# EAGLE schematic 1stLayer2018v1 (EAGLE 9.2.2)

## Sheet 1 of 8: Light Sensor Circuit
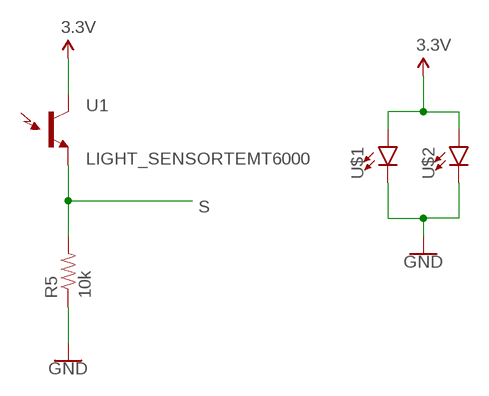
[diagram p0: schematic, sheet 1]

### Parts
R5  10k  10KOHM-0603-1/10W-1%  [0603]
U1  LIGHT_SENSORTEMT6000  [TEMT6000]
U$1  3528LED  [3528]
U$2  3528LED  [3528]

### Nets
3.3V: U1.COLLECTOR(C1) U$1.A U$2.A ; also sheet 2,3,4,7
GND: R5.1 U$1.C U$2.C ; also sheet 2,3,4,5,7
S: R5.2 U1.EMITTER(E1)

## Sheet 2 of 8: TPS5450 Buck Circuit
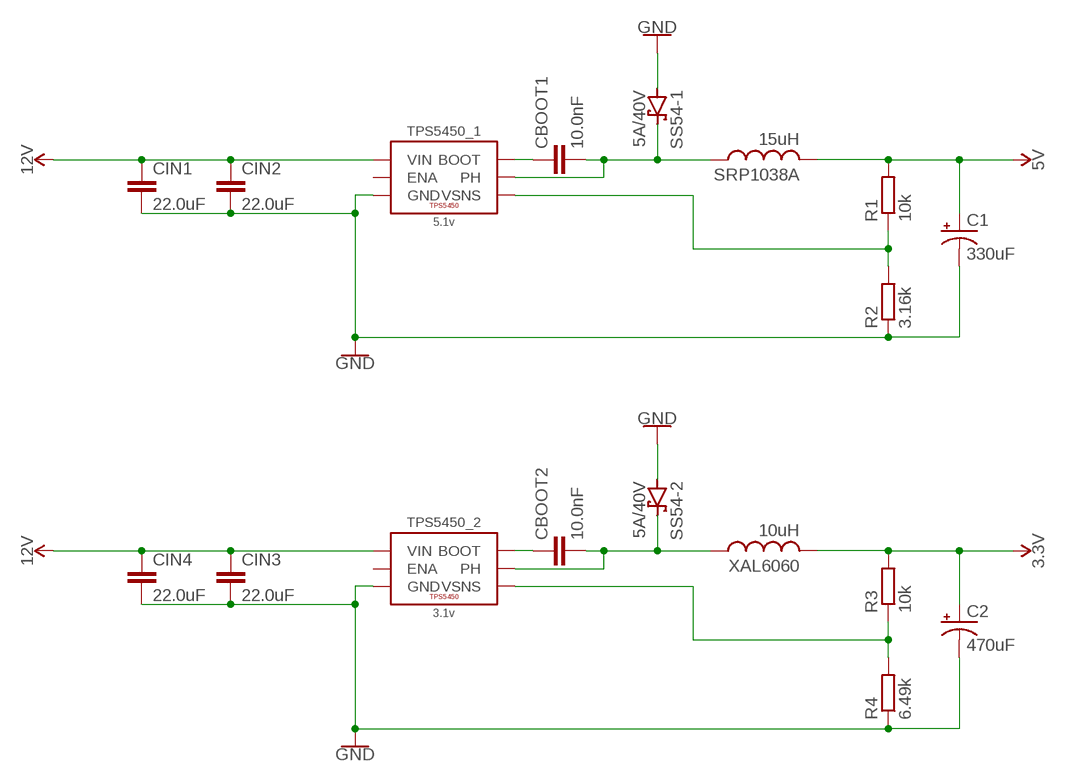
[diagram p1: schematic, sheet 2]

### Parts
C1  330uF  CPOL-USD/7343-31R  [D/7343-31R]
C2  470uF  CPOL-USD/7343-31R  [D/7343-31R]
CBOOT1  10.0nF  C-EUC0603  [C0603]
CBOOT2  10.0nF  C-EUC0603  [C0603]
CIN1  22.0uF  C-EUC1210  [C1210]
CIN2  22.0uF  C-EUC1210  [C1210]
CIN3  22.0uF  C-EUC1210  [C1210]
CIN4  22.0uF  C-EUC1210  [C1210]
R1  10k  R-EU_R0603  [R0603]
R2  3.16k  R-EU_R0603  [R0603]
R3  10k  R-EU_R0603  [R0603]
R4  6.49k  R-EU_R0603  [R0603]
SRP1038A  15uH  SRP1038A  [SRP1038A]
SS54-1  5A/40V  SCHOTTKY-DIODESMD  [SMB]
SS54-2  5A/40V  SCHOTTKY-DIODESMD  [SMB]
TPS5450_1  5.1v  TPS5450  [POWERPAD-SOIC-8]
TPS5450_2  3.1v  TPS5450  [POWERPAD-SOIC-8]
XAL6060  10uH  XAL6060  [XAL6060]

### Nets
3.3V: C2.+ R3.2 XAL6060.2 ; also sheet 1,3,4,7
5V: C1.+ R1.2 SRP1038A.2 ; also sheet 3
12V: CIN1.1 CIN2.1 CIN3.1 CIN4.1 TPS5450_1.7(VIN) TPS5450_2.7(VIN) ; also sheet 3,4,5
GND: C1.- C2.- CIN1.2 CIN2.2 CIN3.2 CIN4.2 R2.1 R4.1 SS54-1.A SS54-2.A TPS5450_1.6(GND) TPS5450_1.9(GND) TPS5450_2.6(GND) TPS5450_2.9(GND) ; also sheet 1,3,4,5,7
N$1: CBOOT1.2 SRP1038A.1 SS54-1.C TPS5450_1.8(PH)
N$2: CBOOT2.1 TPS5450_2.1(BOOT)
N$3: CBOOT1.1 TPS5450_1.1(BOOT)
N$4: R1.1 R2.2 TPS5450_1.4(VSNS)
N$5: CBOOT2.2 SS54-2.C TPS5450_2.8(PH) XAL6060.1
N$6: R3.1 R4.2 TPS5450_2.4(VSNS)
Unconnected: TPS5450_1.2(NC) TPS5450_1.3(NC) TPS5450_1.5(ENA) TPS5450_2.2(NC) TPS5450_2.3(NC) TPS5450_2.5(ENA)

## Sheet 3 of 8: MAX1522 Boost Converter Circuit
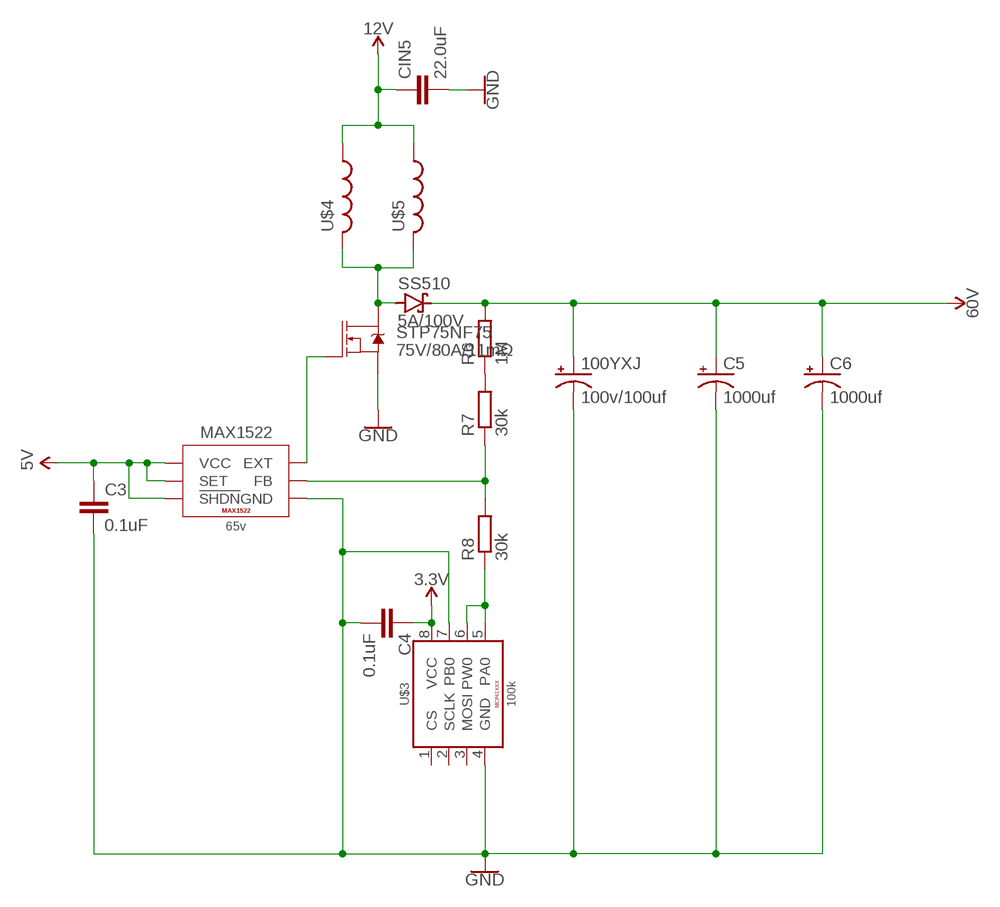
[diagram p2: schematic, sheet 3]

### Parts
100YXJ  100v/100uf  CPOL-USE5-10.5  [E5-10,5]
C3  0.1uF  C-EUC0603  [C0603]
C4  0.1uF  C-EUC0603  [C0603]
C5  1000uf  100UF-CAP  [1000UF-CAP]
C6  1000uf  100UF-CAP  [1000UF-CAP]
CIN5  22.0uF  C-EUC1210  [C1210]
MAX1522  65v  MAX1522EUT+T  [SOT23-6]
R6  1M  R-EU_R0603  [R0603]
R7  30k  R-EU_R0603  [R0603]
R8  30k  R-EU_R0603  [R0603]
SS510  5A/100V  SCHOTTKY-DIODESMD  [SMB]
STP75NF75  75V/80A/11mΩ  MOSFET-NCH-FQP30N06L  [TO220V]
U$3  100k  MCP41XXX  [SOIC-8]
U$4  CDRH127  [127]
U$5  CDRH127  [127]

### Nets
3.3V: C4.1 U$3.8(VCC) ; also sheet 1,2,4,7
5V: C3.1 MAX1522.3(SET) MAX1522.4(!SHDN) MAX1522.6(VCC) ; also sheet 2
12V: CIN5.1 U$4.1 U$5.1 ; also sheet 2,4,5
60V: 100YXJ.+ C5.+ C6.+ R6.2 SS510.C
GND: 100YXJ.- C3.2 C4.2 C5.- C6.- CIN5.2 MAX1522.1(GND) STP75NF75.3(S) U$3.4(GND) U$3.7(PB0) ; also sheet 1,2,4,5,7
N$7: R6.1 R7.2
N$8: MAX1522.2(FB) R7.1 R8.2
N$9: MAX1522.5(EXT) STP75NF75.1(G)
N$10: R8.1 U$3.5(PA0) U$3.6(PW0)
N$11: SS510.A STP75NF75.2(D) U$4.2 U$5.2
Unconnected: U$3.1(CS) U$3.2(SCLK) U$3.3(MOSI)

## Sheet 4 of 8: VNH5050 Motor Driver Circuit
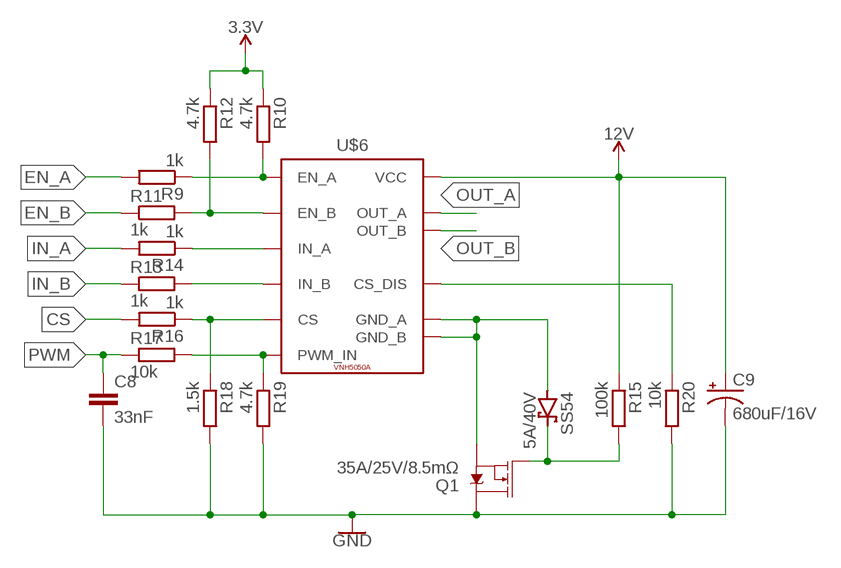
[diagram p3: schematic, sheet 4]

### Parts
C8  33nF  C-EUC0603  [C0603]
C9  680uF/16V  CPOL-USE3.5-8  [E3,5-8]
Q1  35A/25V/8.5mΩ  MOSFET-NCH-FDD8780  [DPAK]
R9  1k  R-EU_R0603  [R0603]
R10  4.7k  R-EU_R0603  [R0603]
R11  1k  R-EU_R0603  [R0603]
R12  4.7k  R-EU_R0603  [R0603]
R13  1k  R-EU_R0603  [R0603]
R14  1k  R-EU_R0603  [R0603]
R15  100k  R-EU_R0603  [R0603]
R16  1k  R-EU_R0603  [R0603]
R17  10k  R-EU_R0603  [R0603]
R18  1.5k  R-EU_R0603  [R0603]
R19  4.7k  R-EU_R0603  [R0603]
R20  10k  R-EU_R0603  [R0603]
SS54  5A/40V  SCHOTTKY-DIODESMD  [SMB]
U$6  VNH5050A  [POWERSSO-36]

### Nets
3.3V: R10.1 R12.1 ; also sheet 1,2,3,7
12V: C9.+ R15.1 U$6.1(VCC) U$6.P13(VCC) U$6.P24(VCC) ; also sheet 2,3,5
CS: R16.2
EN_A: R9.2
EN_B: R11.1
GND: C8.2 C9.- Q1.4(D) R18.2 R19.2 R20.2 ; also sheet 1,2,3,5,7
IN_A: R14.2
IN_B: R13.1
N$12: R9.1 R10.2 U$6.P16(EN_A)
N$13: R14.1 U$6.P15(IN_A)
N$14: R11.2 R12.2 U$6.P21(EN_B)
N$15: R13.2 U$6.P22(IN_B)
N$16: R17.2 R19.1 U$6.P17(PWM_IN)
N$17: R16.1 R18.1 U$6.P19(CS)
N$19: Q1.3(S) SS54.A U$6.P1(GND_A) U$6.P3(GND_A) U$6.P4(GND_A) U$6.P5(GND_A) U$6.P6(GND_A) U$6.P7(GND_A) U$6.P30(GND_B) U$6.P31(GND_B) U$6.P32(GND_B) U$6.P33(GND_B) U$6.P34(GND_B) U$6.P36(GND_B)
N$20: Q1.1(G) R15.2 SS54.C
N$21: R20.1 U$6.P20(CS_DIS)
OUT_A: U$6.2(OUT_A) U$6.P2(OUT_A) U$6.P8(OUT_A) U$6.P9(OUT_A) U$6.P10(OUT_A) U$6.P11(OUT_A) U$6.P12(OUT_A) U$6.P14(OUT_A)
OUT_B: U$6.3(OUT_B) U$6.P23(OUT_B) U$6.P25(OUT_B) U$6.P26(OUT_B) U$6.P27(OUT_B) U$6.P28(OUT_B) U$6.P29(OUT_B) U$6.P35(OUT_B)
PWM: C8.1 R17.1
Unconnected: U$6.P18(NC)

## Sheet 5 of 8: Solenoid MOSFET Switch Circuit
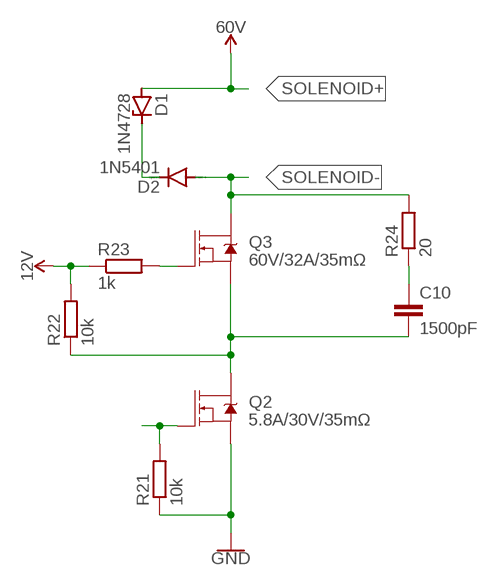
[diagram p4: schematic, sheet 5]

### Parts
C10  1500pF  C-EUC0603  [C0603]
D1  1N4728  [DO41Z10]
D2  1N5401  1N5400  [DO201-15]
Q2  5.8A/30V/35mΩ  MOSFET-NCH-AO3404A  [SOT23-3]
Q3  60V/32A/35mΩ  MOSFET-NCH-FQP30N06L  [TO220V]
R21  10k  R-EU_R0603  [R0603]
R22  10k  R-EU_R0603  [R0603]
R23  1k  R-EU_R0603  [R0603]
R24  20  R-EU_R0603  [R0603]

### Nets
12V: R22.2 R23.1 ; also sheet 2,3,4
GND: Q2.2(S) R21.1 ; also sheet 1,2,3,4,7
N$18: Q2.1(G) R21.2
N$22: C10.2 Q2.3(D) Q3.3(S) R22.1
N$23: Q3.1(G) R23.2
N$24: D1.C D2.C
N$26: C10.1 R24.1
SOLENOID+: D1.A ; supply symbol labelled 60V
SOLENOID-: D2.A Q3.2(D) R24.2

## Sheet 6 of 8: STM32 "New Pill" Circuit

## Sheet 7 of 8: Analog MUX Circuit
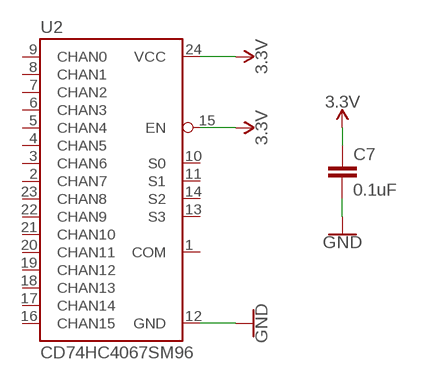
[diagram p5: schematic, sheet 7]

### Parts
C7  0.1uF  C-EUC0603  [C0603]
U2  CD74HC4067SM96  74HC4067SM96  [SSOP24]

### Nets
3.3V: C7.1 U2.15(EN) U2.24(VCC) ; also sheet 1,2,3,4
GND: C7.2 U2.12(GND) ; also sheet 1,2,3,4,5
Unconnected: U2.1(COM) U2.2(CHAN7) U2.3(CHAN6) U2.4(CHAN5) U2.5(CHAN4) U2.6(CHAN3) U2.7(CHAN2) U2.8(CHAN1) U2.9(CHAN0) U2.10(S0) U2.11(S1) U2.13(S3) U2.14(S2) U2.16(CHAN15) U2.17(CHAN14) U2.18(CHAN13) U2.19(CHAN12) U2.20(CHAN11) U2.21(CHAN10) U2.22(CHAN9) U2.23(CHAN8)

## Sheet 8 of 8: ADXL345 Accelerometer Circuit

## Library data of the parts
100YXJ C1 C2 C9 = rcl:CPOL-US: POLARIZED CAPACITOR, American symbol; SPICEPREFIX: C
C3 C4 C7 C8 C10 CBOOT1 CBOOT2 CIN1-CIN5 = rcl:C-EU: CAPACITOR, European symbol; SPICEPREFIX: C
C5 C6 = JH:100UF-CAP
D1 = diode:1N4728: Z DIODE 3.3 V, 1W, 5 percent
D2 = diode:1N5400: DIODE standard rectifier, 3 A, 50 V (Motorola)
MAX1522 = JH:MAX1522EUT+T; MANUFACTURER_PART_NUMBER: MAX1522EUT+T; VENDOR: MAXIM
Q1 = SparkFun-DiscreteSemi:MOSFET-NCH: N-channel MOSFETs Voltage controlled devices that allow control of high current outputs. SparkFun Products: SparkFun OpenScale <https://www.sparkfun.com/products/13261> SparkFun Digital Sandbox <https://www.sparkfun.com/products/12651> SparkFun Monster Moto Shield <https://www.sparkfun.com/products/10182> SparkFun MOSFET Power Controller <https://www.sparkfun.com/products/11214>; PROD_ID: TRANS-09984
Q2 = SparkFun-DiscreteSemi:MOSFET-NCH: N-channel MOSFETs Voltage controlled devices that allow control of high current outputs. SparkFun Products: SparkFun OpenScale <https://www.sparkfun.com/products/13261> SparkFun Digital Sandbox <https://www.sparkfun.com/products/12651> SparkFun Monster Moto Shield <https://www.sparkfun.com/products/10182> SparkFun MOSFET Power Controller <https://www.sparkfun.com/products/11214>; PROD_ID: TRANS-12988
Q3 = SparkFun-DiscreteSemi:MOSFET-NCH: N-channel MOSFETs Voltage controlled devices that allow control of high current outputs. SparkFun Products: SparkFun OpenScale <https://www.sparkfun.com/products/13261> SparkFun Digital Sandbox <https://www.sparkfun.com/products/12651> SparkFun Monster Moto Shield <https://www.sparkfun.com/products/10182> SparkFun MOSFET Power Controller <https://www.sparkfun.com/products/11214>; PROD_ID: TRANS-10060
R1-R4 R6-R24 = rcl:R-EU_: RESISTOR, European symbol; SPICEPREFIX: R
R5 = SparkFun-Resistors:10KOHM: 10kΩ resistor A resistor is a passive two-terminal electrical component that implements electrical resistance as a circuit element. Resistors act to reduce current flow, and, at the same time, act to lower voltage levels within circuits. - Wikipedia; PROD_ID: RES-00824
SRP1038A = JH:SRP1038A
SS54 SS54-1 SS54-2 SS510 = diode:SCHOTTKY-DIODE: Schottky Diode
STP75NF75 = SparkFun-DiscreteSemi:MOSFET-NCH: N-channel MOSFETs Voltage controlled devices that allow control of high current outputs. SparkFun Products: SparkFun OpenScale <https://www.sparkfun.com/products/13261> SparkFun Digital Sandbox <https://www.sparkfun.com/products/12651> SparkFun Monster Moto Shield <https://www.sparkfun.com/products/10182> SparkFun MOSFET Power Controller <https://www.sparkfun.com/products/11214>; PROD_ID: TRANS-10060; VALUE: 60V/32A/35mΩ
TPS5450_1 TPS5450_2 = JH:TPS5450
U1 = SparkFun-Sensors:LIGHT_SENSOR: Ambient Light Sensors - Phototransistors Low cost ambient light sensors, consisting of a phototransistor in miniature SMD packages. Output voltage varies with light intensity. SparkFun Products ALS-PT19 Light Sensor <https://www.sparkfun.com/products/12566> (SEN-12566) Ambient Light Sensor - TEMT6000 <https://www.sparkfun.com/products/8348> (SEN-08348) SparkFun Ambient Light Sensor Breakout - TEMT60000 <https://www.sparkfun.com/products/8688> (SEN-08688); PROD_ID: COMP-08569; SF_ID: COM-08348
U2 = SparkFun-IC-Logic:74*4067: 16-channel analog MUX Datasheet <http://www.sparkfun.com/datasheets/IC/cd74hc4067.pdf> SparkFun Products MP3 Trigger <https://www.sparkfun.com/products/13720> (WIG-13720) SparkFun Analog/Digital MUX Breakout - CD74HC4067 <https://www.sparkfun.com/products/9056> (BOB-09056); PROD_ID: IC-08252
U$1 U$2 = JH:3528LED
U$3 = JH:MCP41XXX
U$4 U$5 = JH:CDRH127
U$6 = JH:VNH5050A
XAL6060 = JH:XAL6060